# Altium schematic sheet MB1272-TOP.SchDoc: MB1272-TOP
size A4; CompanyName: STMicroelectronics; DocumentNumber: MB1272; Revision: B-01; SheetNumber: 2; SheetTotal: 15; Project: STM32MP15-DISCO PI
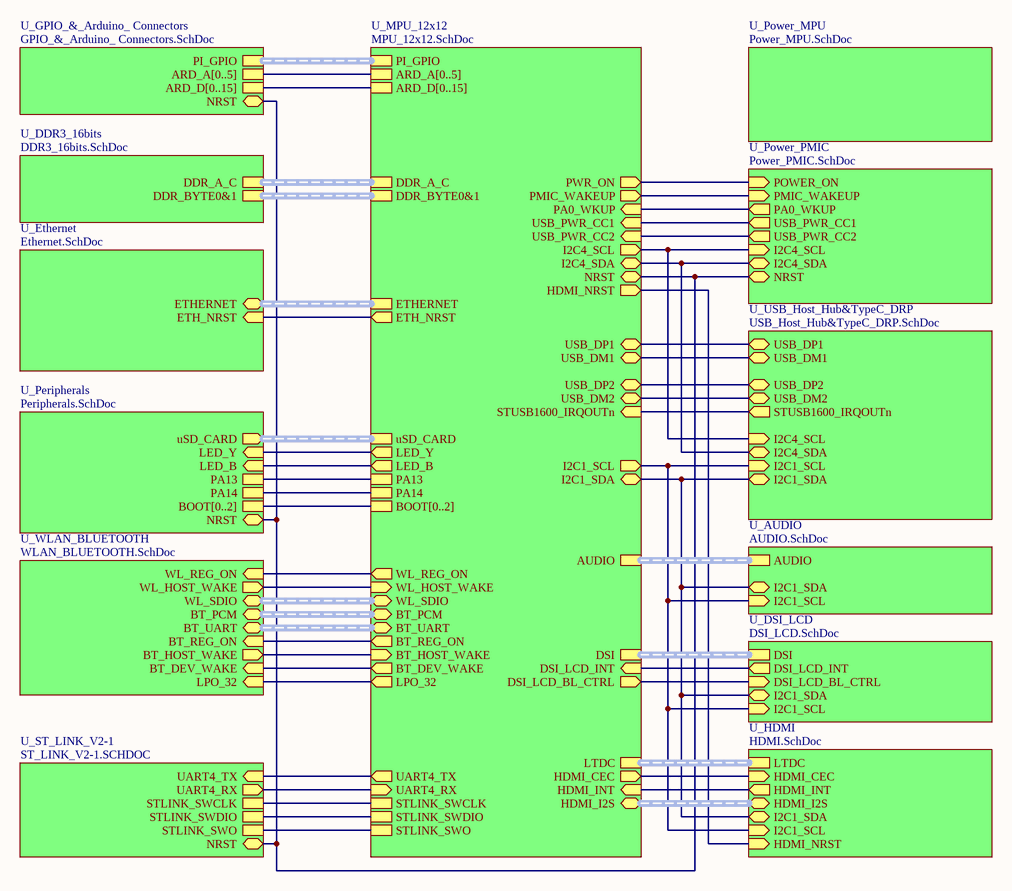
[diagram p0: MB1272-TOP.SchDoc]

## Sub-sheets
U_AUDIO = AUDIO.SchDoc: I2C1_SCL (in), I2C1_SDA (bidir), AUDIO (harness AUDIO)
U_DDR3_16bits = DDR3_16bits.SchDoc: DDR_A_C (harness DDR_A_C), DDR_BYTE0&1 (harness DDR_BYTE_0&1)
U_DSI_LCD = DSI_LCD.SchDoc: DSI (harness DSI), I2C1_SDA (bidir), I2C1_SCL (in), DSI_LCD_BL_CTRL (in), DSI_LCD_INT (out)
U_Ethernet = Ethernet.SchDoc: ETHERNET (harness ETHERNET), ETH_NRST (in)
U_GPIO_&_Arduino_ Connectors = GPIO_&_Arduino_ Connectors.SchDoc: NRST (bidir), ARD_A[0..5], ARD_D[0..15], PI_GPIO (harness PI_GPIO)
U_HDMI = HDMI.SchDoc: LTDC (harness LTDC), HDMI_CEC (in), I2C1_SDA (bidir), HDMI_INT (out), I2C1_SCL (in), HDMI_I2S (harness HDMI_I2S), HDMI_NRST (in)
U_MPU_12x12 = MPU_12x12.SchDoc: DDR_BYTE0&1 (harness DDR_BYTE_0&1), DDR_A_C (harness DDR_A_C), STLINK_SWDIO, STLINK_SWCLK, STLINK_SWO, UART4_TX (out), UART4_RX (in), PA13, PA14, PI_GPIO (harness PI_GPIO), ETHERNET (harness ETHERNET), AUDIO (harness AUDIO), PMIC_WAKEUP (out), PA0_WKUP (in), NRST (bidir), PWR_ON (out), I2C4_SCL (out), I2C4_SDA (bidir), DSI (harness DSI), LTDC (harness LTDC), HDMI_CEC (out), uSD_CARD (harness uSD_CARD), BOOT[0..2], ARD_A[0..5], ARD_D[0..15], I2C1_SDA (bidir), I2C1_SCL (out), USB_DM1 (bidir), USB_DM2 (bidir), USB_DP2 (bidir), USB_DP1 (bidir), DSI_LCD_BL_CTRL (out), DSI_LCD_INT (in), HDMI_INT (in), WL_SDIO (harness WLAN_SDIO), BT_PCM (harness BT_PCM), BT_UART (harness BT_UART), BT_REG_ON (out), BT_HOST_WAKE (in), WL_REG_ON (out), BT_DEV_WAKE (out), WL_HOST_WAKE (in), HDMI_I2S (harness HDMI_I2S), STUSB1600_IRQOUTn (in), LPO_32 (out), USB_PWR_CC1 (in), USB_PWR_CC2 (in), LED_Y (out), LED_B (out), HDMI_NRST (out), ETH_NRST (out)
U_Peripherals = Peripherals.SchDoc: BOOT[0..2], PA13, PA14, NRST (bidir), uSD_CARD (harness uSD_CARD), LED_B (in), LED_Y (in)
U_Power_MPU = Power_MPU.SchDoc: no entries
U_Power_PMIC = Power_PMIC.SchDoc: I2C4_SDA (bidir), I2C4_SCL (in), PA0_WKUP (out), NRST (bidir), POWER_ON (in), PMIC_WAKEUP (in), USB_PWR_CC1 (out), USB_PWR_CC2 (out)
U_ST_LINK_V2-1 = ST_LINK_V2-1.SCHDOC: NRST (bidir), STLINK_SWO, STLINK_SWDIO, STLINK_SWCLK, UART4_RX (out), UART4_TX (in)
U_USB_Host_Hub&TypeC_DRP = USB_Host_Hub&TypeC_DRP.SchDoc: USB_DP1 (bidir), USB_DM1 (bidir), I2C1_SDA (bidir), I2C1_SCL (in), STUSB1600_IRQOUTn (out), I2C4_SCL (in), I2C4_SDA (bidir), USB_DM2 (bidir), USB_DP2 (bidir)
U_WLAN_BLUETOOTH = WLAN_BLUETOOTH.SchDoc: WL_SDIO (harness WLAN_SDIO), BT_UART (harness BT_UART), BT_PCM (harness BT_PCM), BT_REG_ON (in), BT_HOST_WAKE (out), WL_REG_ON (in), BT_DEV_WAKE (in), WL_HOST_WAKE (out), LPO_32 (in)

## Nets
(unnamed): sheet U_Power_PMIC/I2C4_SDA, sheet U_MPU_12x12/I2C4_SDA, sheet U_USB_Host_Hub&TypeC_DRP/I2C4_SDA
(unnamed): sheet U_Power_PMIC/I2C4_SCL, sheet U_MPU_12x12/I2C4_SCL, sheet U_USB_Host_Hub&TypeC_DRP/I2C4_SCL
(unnamed): sheet U_Power_PMIC/PA0_WKUP, sheet U_MPU_12x12/PA0_WKUP
(unnamed): sheet U_Power_PMIC/NRST, sheet U_MPU_12x12/NRST, sheet U_Peripherals/NRST, sheet U_ST_LINK_V2-1/NRST, sheet U_GPIO_&_Arduino_ Connectors/NRST
(unnamed): sheet U_Power_PMIC/POWER_ON, sheet U_MPU_12x12/PWR_ON
(unnamed): sheet U_Power_PMIC/PMIC_WAKEUP, sheet U_MPU_12x12/PMIC_WAKEUP
(unnamed): sheet U_Power_PMIC/USB_PWR_CC1, sheet U_MPU_12x12/USB_PWR_CC1
(unnamed): sheet U_Power_PMIC/USB_PWR_CC2, sheet U_MPU_12x12/USB_PWR_CC2
(unnamed): sheet U_MPU_12x12/STLINK_SWDIO, sheet U_ST_LINK_V2-1/STLINK_SWDIO
(unnamed): sheet U_MPU_12x12/STLINK_SWCLK, sheet U_ST_LINK_V2-1/STLINK_SWCLK
(unnamed): sheet U_MPU_12x12/STLINK_SWO, sheet U_ST_LINK_V2-1/STLINK_SWO
(unnamed): sheet U_MPU_12x12/UART4_TX, sheet U_ST_LINK_V2-1/UART4_TX
(unnamed): sheet U_MPU_12x12/UART4_RX, sheet U_ST_LINK_V2-1/UART4_RX
(unnamed): sheet U_MPU_12x12/PA13, sheet U_Peripherals/PA13
(unnamed): sheet U_MPU_12x12/PA14, sheet U_Peripherals/PA14
(unnamed): sheet U_MPU_12x12/HDMI_CEC, sheet U_HDMI/HDMI_CEC
(unnamed): sheet U_MPU_12x12/I2C1_SDA, sheet U_DSI_LCD/I2C1_SDA, sheet U_HDMI/I2C1_SDA, sheet U_USB_Host_Hub&TypeC_DRP/I2C1_SDA, sheet U_AUDIO/I2C1_SDA
(unnamed): sheet U_MPU_12x12/I2C1_SCL, sheet U_DSI_LCD/I2C1_SCL, sheet U_HDMI/I2C1_SCL, sheet U_USB_Host_Hub&TypeC_DRP/I2C1_SCL, sheet U_AUDIO/I2C1_SCL
(unnamed): sheet U_MPU_12x12/USB_DM1, sheet U_USB_Host_Hub&TypeC_DRP/USB_DM1
(unnamed): sheet U_MPU_12x12/USB_DM2, sheet U_USB_Host_Hub&TypeC_DRP/USB_DM2
(unnamed): sheet U_MPU_12x12/USB_DP2, sheet U_USB_Host_Hub&TypeC_DRP/USB_DP2
(unnamed): sheet U_MPU_12x12/USB_DP1, sheet U_USB_Host_Hub&TypeC_DRP/USB_DP1
(unnamed): sheet U_MPU_12x12/DSI_LCD_BL_CTRL, sheet U_DSI_LCD/DSI_LCD_BL_CTRL
(unnamed): sheet U_MPU_12x12/DSI_LCD_INT, sheet U_DSI_LCD/DSI_LCD_INT
(unnamed): sheet U_MPU_12x12/HDMI_INT, sheet U_HDMI/HDMI_INT
(unnamed): sheet U_MPU_12x12/BT_REG_ON, sheet U_WLAN_BLUETOOTH/BT_REG_ON
(unnamed): sheet U_MPU_12x12/BT_HOST_WAKE, sheet U_WLAN_BLUETOOTH/BT_HOST_WAKE
(unnamed): sheet U_MPU_12x12/WL_REG_ON, sheet U_WLAN_BLUETOOTH/WL_REG_ON
(unnamed): sheet U_MPU_12x12/BT_DEV_WAKE, sheet U_WLAN_BLUETOOTH/BT_DEV_WAKE
(unnamed): sheet U_MPU_12x12/WL_HOST_WAKE, sheet U_WLAN_BLUETOOTH/WL_HOST_WAKE
(unnamed): sheet U_MPU_12x12/STUSB1600_IRQOUTn, sheet U_USB_Host_Hub&TypeC_DRP/STUSB1600_IRQOUTn
(unnamed): sheet U_MPU_12x12/LPO_32, sheet U_WLAN_BLUETOOTH/LPO_32
(unnamed): sheet U_MPU_12x12/LED_Y, sheet U_Peripherals/LED_Y
(unnamed): sheet U_MPU_12x12/LED_B, sheet U_Peripherals/LED_B
(unnamed): sheet U_MPU_12x12/HDMI_NRST, sheet U_HDMI/HDMI_NRST
(unnamed): sheet U_MPU_12x12/ETH_NRST, sheet U_Ethernet/ETH_NRST

## Buses and harness runs
bus sheet U_GPIO_&_Arduino_ Connectors/ARD_A[0..5] = sheet U_MPU_12x12/ARD_A[0..5]
bus sheet U_GPIO_&_Arduino_ Connectors/ARD_D[0..15] = sheet U_MPU_12x12/ARD_D[0..15]
bus sheet U_MPU_12x12/BOOT[0..2] = sheet U_Peripherals/BOOT[0..2]
harness sheet U_AUDIO/AUDIO = sheet U_MPU_12x12/AUDIO
harness sheet U_DDR3_16bits/DDR_A_C = sheet U_MPU_12x12/DDR_A_C
harness sheet U_DDR3_16bits/DDR_BYTE0&1 = sheet U_MPU_12x12/DDR_BYTE0&1
harness sheet U_DSI_LCD/DSI = sheet U_MPU_12x12/DSI
harness sheet U_Ethernet/ETHERNET = sheet U_MPU_12x12/ETHERNET
harness sheet U_GPIO_&_Arduino_ Connectors/PI_GPIO = sheet U_MPU_12x12/PI_GPIO
harness sheet U_HDMI/HDMI_I2S = sheet U_MPU_12x12/HDMI_I2S
harness sheet U_HDMI/LTDC = sheet U_MPU_12x12/LTDC
harness sheet U_MPU_12x12/BT_PCM = sheet U_WLAN_BLUETOOTH/BT_PCM
harness sheet U_MPU_12x12/BT_UART = sheet U_WLAN_BLUETOOTH/BT_UART
harness sheet U_MPU_12x12/uSD_CARD = sheet U_Peripherals/uSD_CARD
harness sheet U_MPU_12x12/WL_SDIO = sheet U_WLAN_BLUETOOTH/WL_SDIO

## Notes on the sheet
- Title:
- Project:
- Size:
- Revision:
- Variant:
- A4
- -
- Date:
- Reference:
- Sheet:
- of